# EAGLE schematic hw2 (EAGLE 7.5.0)
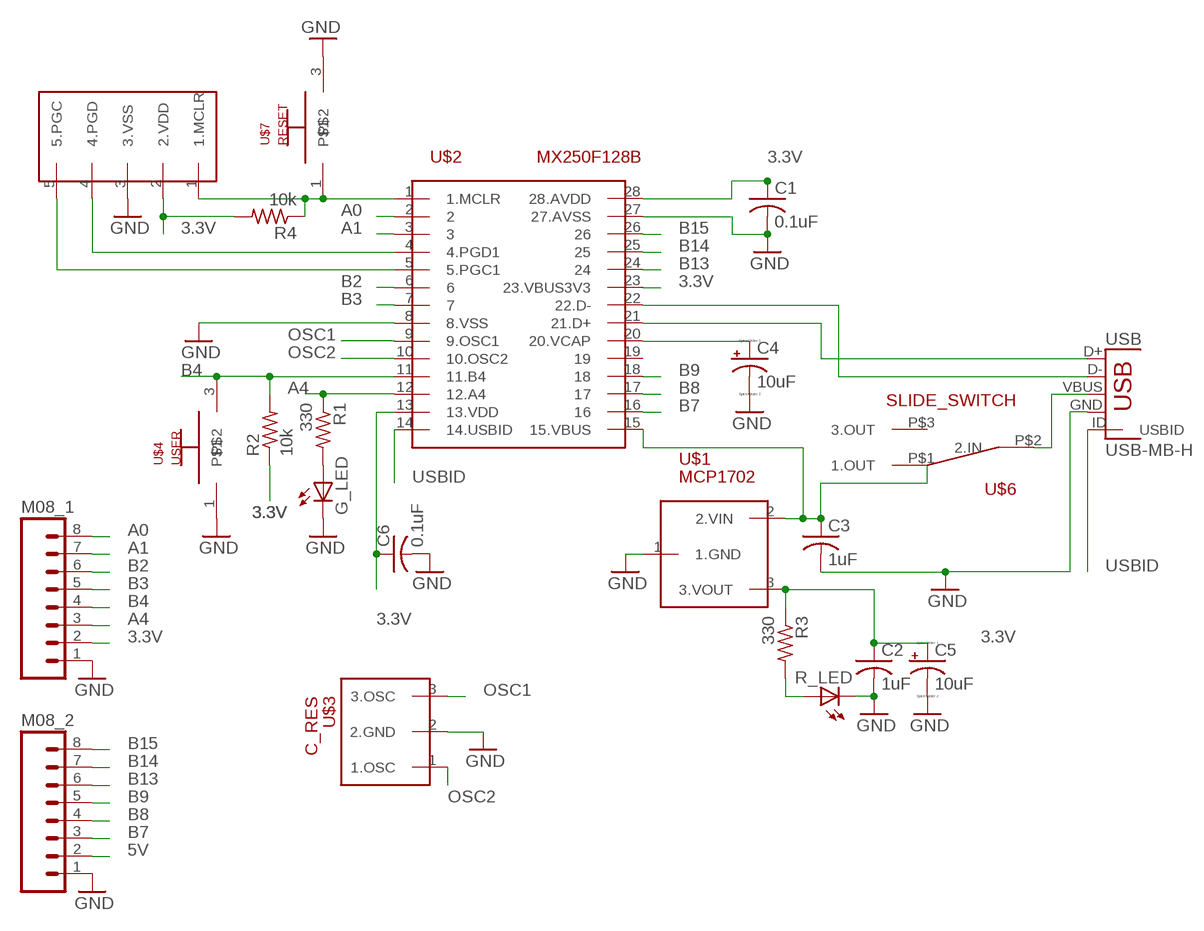
[diagram p0: schematic, sheet 1]

## Parts
C1  0.1uF  C-US025-025X050  [C025-025X050]
C2  1uF  C-US025-025X050  [C025-025X050]
C3  1uF  C-US025-025X050  [C025-025X050]
C4  10uF  CPOL-USE2,5-6E  [E2,5-6E]
C5  10uF  CPOL-USE2,5-6E  [E2,5-6E]
C6  0.1uF  C-US025-025X050  [C025-025X050]
G_LED  LED3MM  [LED3MM]
M08_1  M08  [1X08_ROUND]
M08_2  M08  [1X08_ROUND]
R1  330  R-US_0207/10  [0207/10]
R2  10k  R-US_0207/10  [0207/10]
R3  330  R-US_0207/10  [0207/10]
R4  10k  R-US_0207/10  [0207/10]
R_LED  LED3MM  [LED3MM]
U$1  MCP1702  [TO92]
U$2  MX250F128B  [DIL28-3]
U$3  C_RES  [1X03]
U$4  USER  BUTTON  [1X03]
U$5  PICKIT3  [1X05]
U$6  SLIDE_SWITCH  [SLIDE_SWITCH]
U$7  RESET  BUTTON  [1X03]
USB  USB-MB-H  [USB-MB-H]

## Nets
3.3V: C1.1 C2.1 C5.+ C6.1 M08_1.2 R2.1 R3.1 R4.2 U$1.3(3.VOUT) U$2.13(13.VDD) U$2.23(23.VBUS3V3) U$2.28(28.AVDD) U$5.2(2.VDD)
5V: C3.1 M08_2.2 U$1.2(2.VIN) U$2.15(15.VBUS) U$2.22(22.D-) U$6.P$1(1.OUT) USB.D-
A0: M08_1.8 U$2.2
A1: M08_1.7 U$2.3
A4: M08_1.3 R1.1 U$2.12(12.A4)
B2: M08_1.6 U$2.6
B3: M08_1.5 U$2.7
B4: M08_1.4 R2.2 U$2.11(11.B4) U$4.3
B7: M08_2.3 U$2.16
B8: M08_2.4 U$2.17
B9: M08_2.5 U$2.18
B13: M08_2.6 U$2.24
B14: M08_2.7 U$2.25
B15: M08_2.8 U$2.26
GND: C1.2 C2.2 C3.2 C4.- C5.- C6.2 G_LED.K(C) M08_1.1 M08_2.1 R_LED.K(C) U$1.1(1.GND) U$2.8(8.VSS) U$2.27(27.AVSS) U$3.2(2.GND) U$4.1 U$5.3(3.VSS) U$7.3 USB.GND
N$1: U$6.P$2(2.IN) USB.VBUS
N$2: G_LED.A R1.2
N$5: U$2.21(21.D+) USB.D+
N$7: R3.2 R_LED.A
N$8: C4.+ U$2.20(20.VCAP)
N$10: U$2.4(4.PGD1) U$5.4(4.PGD)
N$11: U$2.5(5.PGC1) U$5.5(5.PGC)
OSC1: U$2.9(9.OSC1) U$3.3(3.OSC)
OSC2: U$2.10(10.OSC2) U$3.1(1.OSC)
RESET: R4.1 U$2.1(1.MCLR) U$5.1(1.MCLR) U$7.1
USBID: U$2.14(14.USBID) USB.ID(USBID)
Unconnected: U$2.19 U$6.P$3(3.OUT)

## Library data of the parts
C1-C3 C6 = hw2:C-US: CAPACITOR, American symbol
C4 C5 = hw2:CPOL-US: POLARIZED CAPACITOR, American symbol
G_LED R_LED = led:LED: LED OSRAM: - CHIPLED LG R971, LG N971, LY N971, LG Q971, LY Q971, LO R971, LY R971 LH N974, LH R974 LS Q976, LO Q976, LY Q976 LO Q996 - Hyper CHIPLED LW Q18S LB Q993, LB Q99A, LB R99A - SideLED LS A670, LO A670, LY A670, LG A670, LP A670 LB A673, LV A673, LT A673, LW A673 LH A674 LY A675 LS A676, LA A676, LO A676, LY A676, LW A676 LS A679, LY A679, LG A679 - Hyper Micro SIDELED® LS Y876, LA Y876, LO Y876, LY Y876 LT Y87S - SmartLED LW L88C, LW L88S LB L89C, LB L89S, LG L890 LS L89K, LO L89K, LY L89K LS L896, LA L896, LO L896, LY L896 - TOPLED LS T670, LO T670, LY T670, LG T670, LP T670 LSG T670, LSP T670, LSY T670, LOP T670, LYG T670 LG T671, LOG T671, LSG T671 LB T673, LV T673, LT T673, LW T673 LH T674 LS T676, LA T676, LO T676, LY T676, LB T676, LH T676, LSB T676, LW T676 LB T67C, LV T67C, LT T67C, LS T67K, LO T67K, LY T67K, LW E67C LS E67B, LA E67B, LO E67B, LY E67B, LB E67C, LV E67C, LT E67C LW T67C LS T679, LY T679, LG T679 LS T770, LO T770, LY T770, LG T770, LP T770 LB T773, LV T773, LT T773, LW T773 LH T774 LS E675, LA E675, LY E675, LS T675 LS T776, LA T776, LO T776, LY T776, LB T776 LHGB T686 LT T68C, LB T68C - Hyper Mini TOPLED® LB M676 - Mini TOPLED Santana® LG M470 LS M47K, LO M47K, LY M47K Source: http://www.osram.convergy.de LUXEON: - LUMILED® LXK2-PW12-R00, LXK2-PW12-S00, LXK2-PW14-U00, LXK2-PW14-V00 LXK2-PM12-R00, LXK2-PM12-S00, LXK2-PM14-U00 LXK2-PE12-Q00, LXK2-PE12-R00, LXK2-PE12-S00, LXK2-PE14-T00, LXK2-PE14-U00 LXK2-PB12-K00, LXK2-PB12-L00, LXK2-PB12-M00, LXK2-PB14-N00, LXK2-PB14-P00, LXK2-PB14-Q00 LXK2-PR12-L00, LXK2-PR12-M00, LXK2-PR14-Q00, LXK2-PR14-R00 LXK2-PD12-Q00, LXK2-PD12-R00, LXK2-PD12-S00 LXK2-PH12-R00, LXK2-PH12-S00 LXK2-PL12-P00, LXK2-PL12-Q00, LXK2-PL12-R00 Source: www.luxeon.com KINGBRIGHT: KA-3528ASYC Source: www.kingbright.com
M08_1 M08_2 = hw2:M08: Header 8 Standard 8-pin 0.1" header. Use with straight break away headers (SKU : PRT-00116), right angle break away headers (PRT-00553), swiss pins (PRT-00743), machine pins (PRT-00117), and female headers (PRT-00115).; PROD_ID: CONN-08437
R1 R3 R4 = resistor:R-US_: RESISTOR, American symbol
R2 = hw2:R-US_: RESISTOR, American symbol
U$1 = hw2:MCP1702
U$2 = hw2:MX250F128B
U$3 = hw2:C_RES
U$4 U$7 = hw2:BUTTON
U$5 = hw2:PICKIT3
U$6 = hw2:SLIDE_SWITCH
USB = hw2:USB: USB Connectors USB-B-PTH is fully proven SKU : PRT-00139/CONN-08278 USB-miniB is fully proven SKU : PRT-00587 USB-A-PCB is untested. USB-A-H is throughly reviewed, but untested. Spark Fun Electronics SKU : PRT-00437 USB-B-SMT is throughly reviewed, but untested. Needs silkscreen touching up. USB-A-S has not been used/tested USB-MB-H has not been used/tested USB-MICROB has been used. CONN-09505